# Altium schematic sheet [02] - BLOCK DIAGRAM.SchDoc
size A2; DocumentNumber: 2; SheetNumber: 2; SheetTotal: 20; PageSetup: Record=PageOptions|CenterHorizontal=True|CenterVertical=True|PrintScale=0.73|XCorrection=1.00|YCorrection=1.00|PrintKind=0|BorderSize=5000000|LeftOffset=0|BottomOffset=0|Orientation=2|PaperLength=1000|PaperWidth=1000|Scale=100|PaperSource=7|PrintQuality=-4|MediaType=1|DitherType=10|PaperKind=A3|PrintScaleMode=1
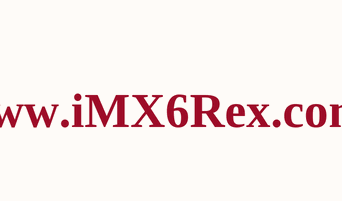
[diagram p0: [02] - BLOCK DIAGRAM.SchDoc, left]
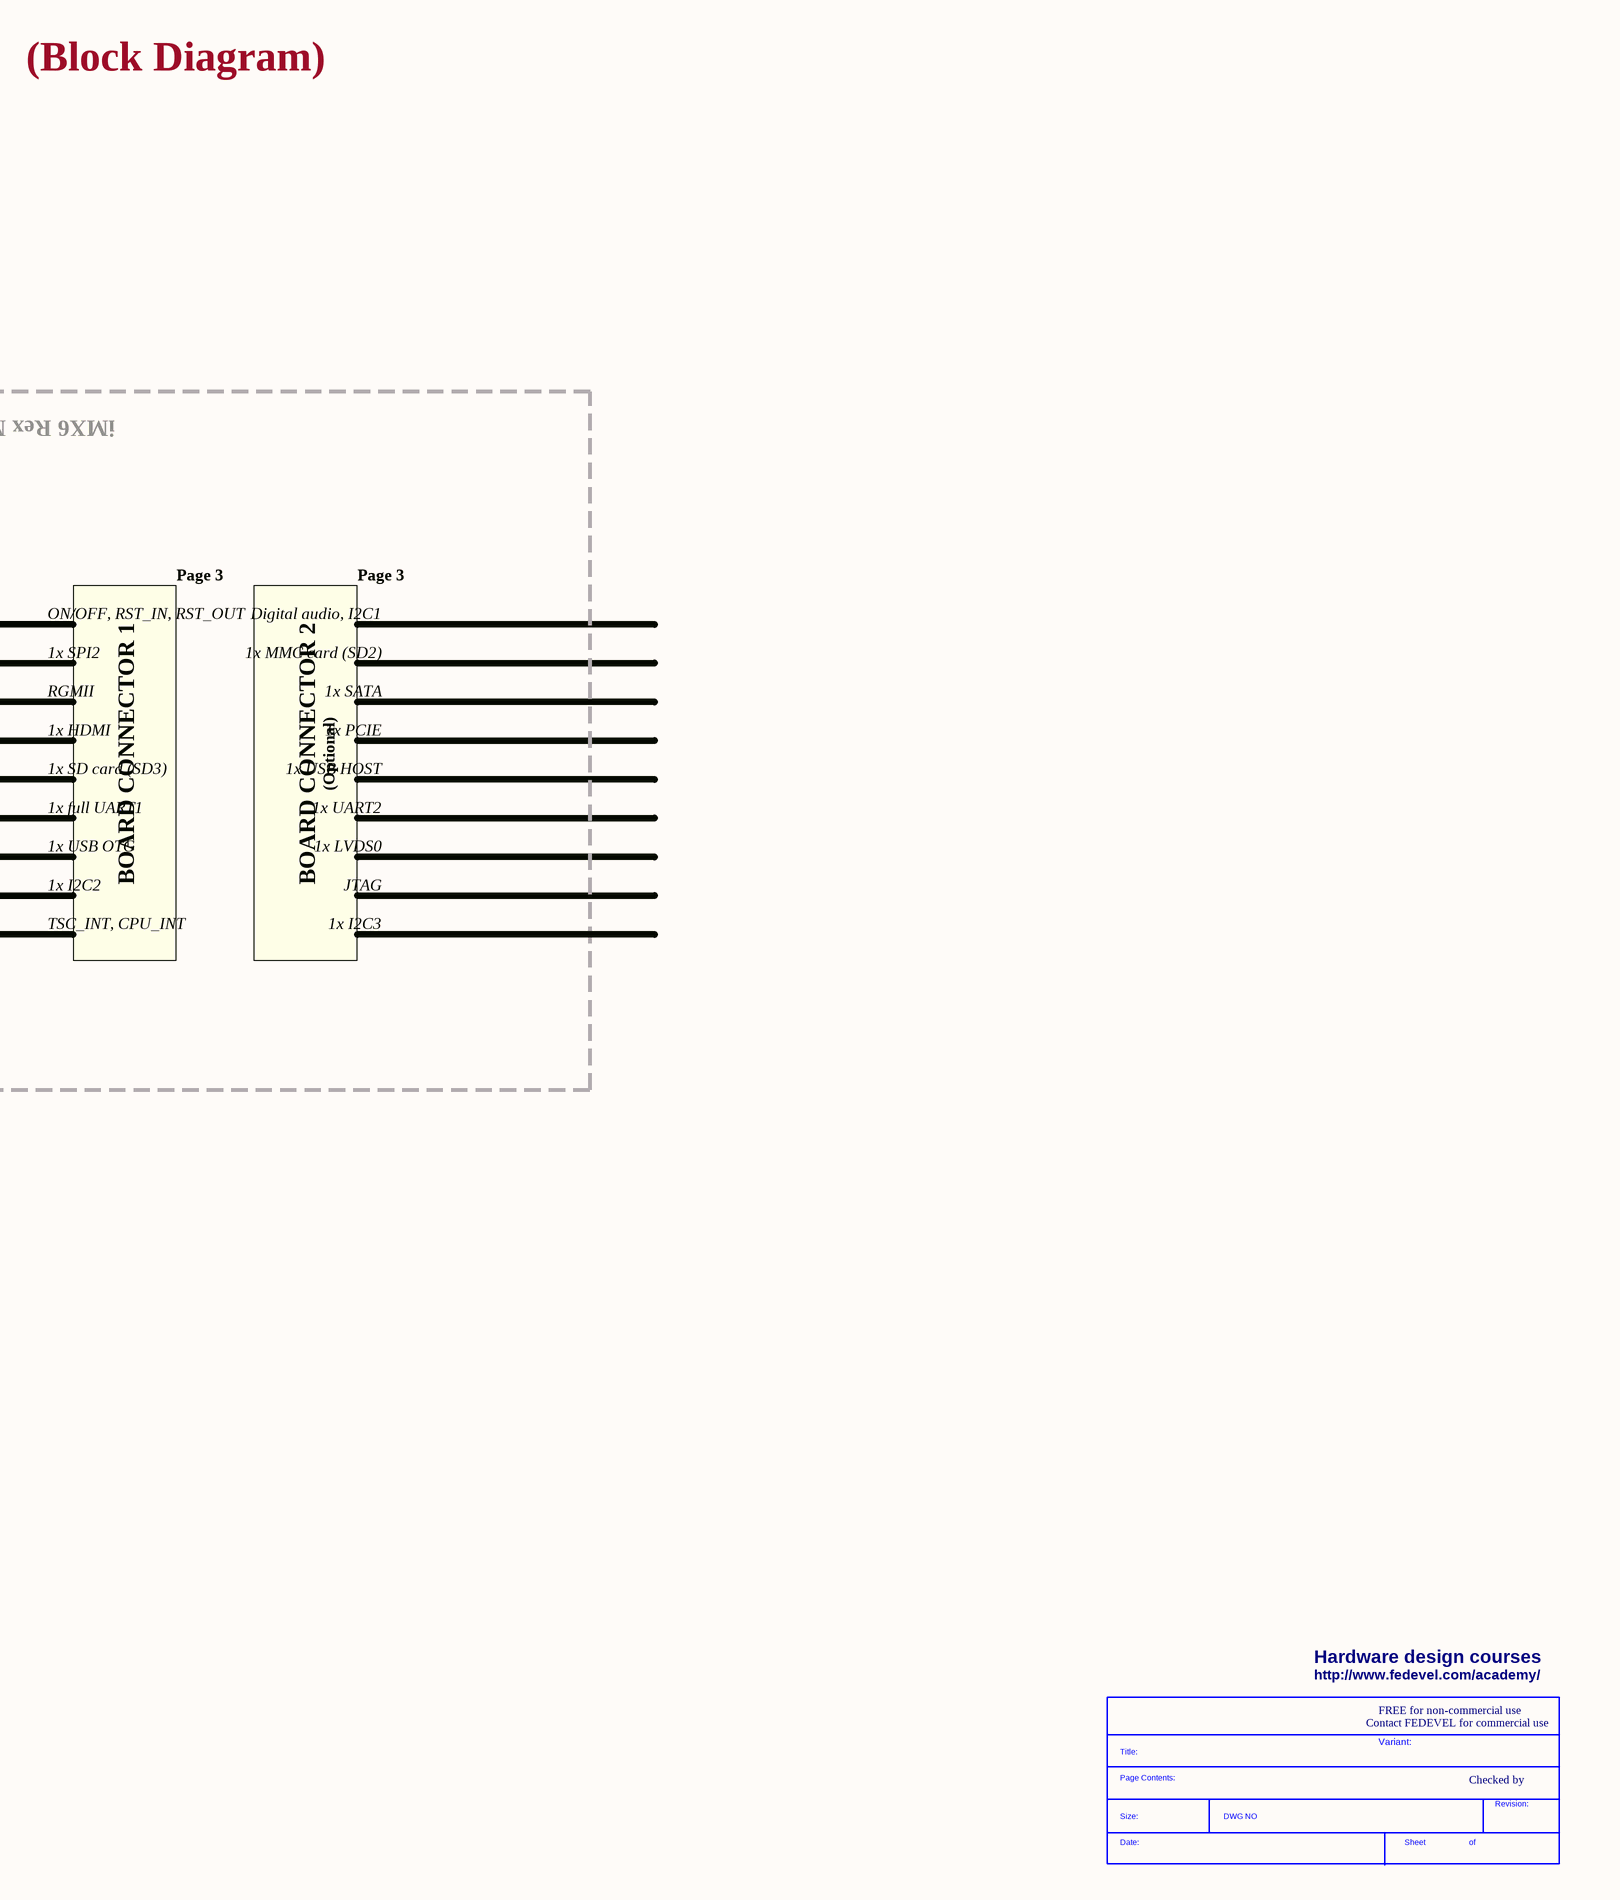
[diagram p1: [02] - BLOCK DIAGRAM.SchDoc, right]

## Parts
*  SDTitleBlock  (value not drawn)  (graphical)

## Notes on the sheet
- (Block Diagram)
- iMX6 Rex Module
- ON/OFF, RST_IN, RST_OUT
- Page 3
- Digital audio, I2C1
- RGMII
- 1x SPI2
- 1x SATA
- 1x MMC card (SD2)
- 1x HDMI
- BOARD CONNECTOR 1
- BOARD CONNECTOR 2
- (Optional)
- 1x PCIE
- 1x SD card (SD3)
- 1x full UART1
- 1x USB HOST
- 1x UART2
- 1x USB OTG
- 1x I2C2
- JTAG
- 1x LVDS0
- TSC_INT, CPU_INT
- 1x I2C3
- Hardware design courses
- http://www.fedevel.com/academy/
- Contact FEDEVEL for commercial use
- FREE for non-commercial use
- Variant:
- Checked by
- http://www.iMX6Rex.com
- (in symbol SDTitleBlock) Title:; Page Contents:; Revision:; Size:; DWG NO; Date:; Sheet; of